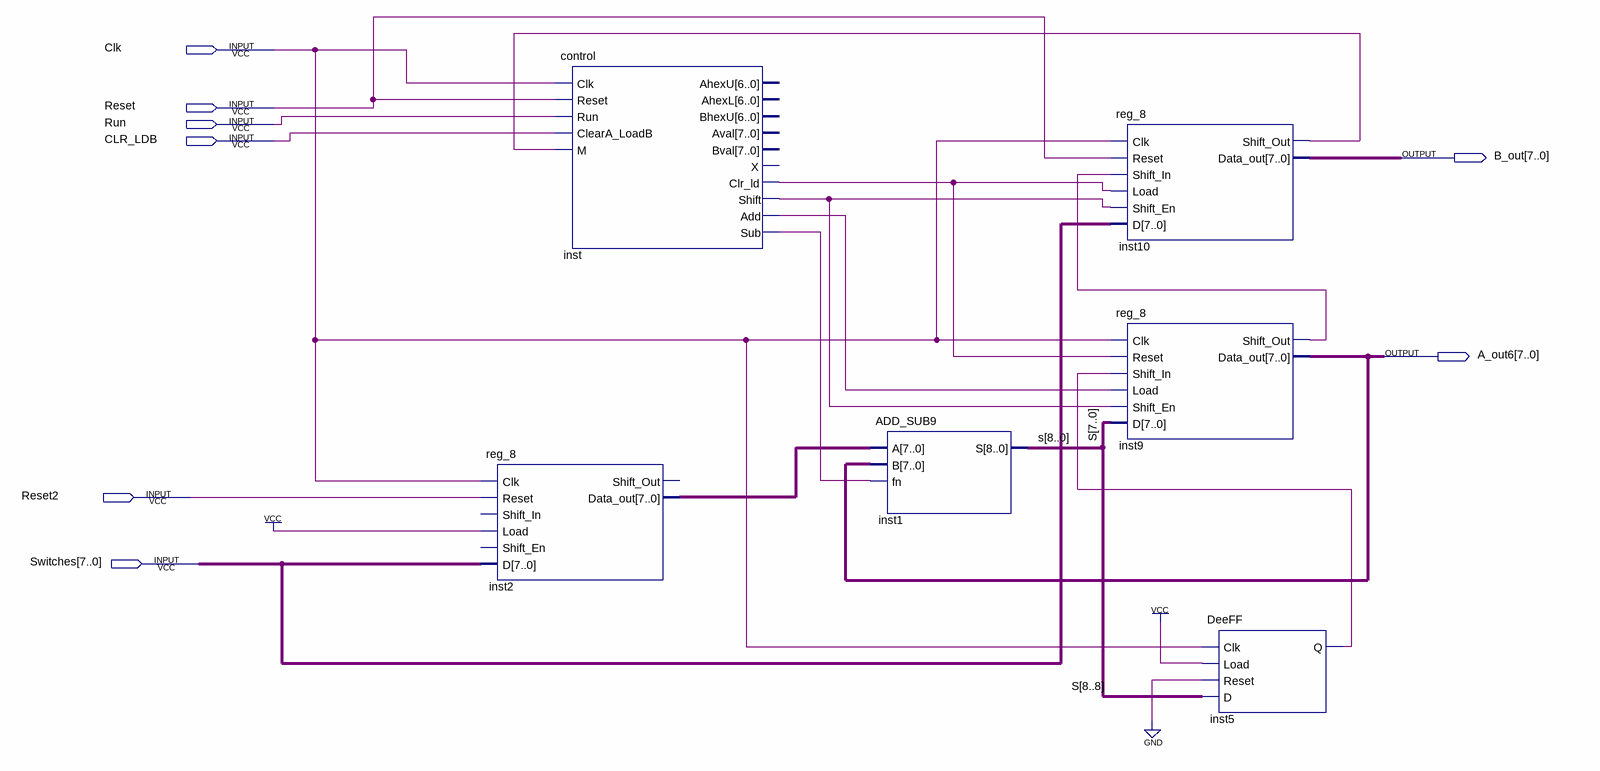
[diagram p0: schematic sheet]
// Quartus schematic my8bitmult.bdf as structural Verilog: 6 symbols, 8 pins
module my8bitmult (
  input  Clk,
  input  Reset,
  input  Run,
  input  CLR_LDB,
  input  Reset2,
  input  [7:0] Switches,
  output [7:0] B_out,
  output [7:0] A_out6
);

  wire inst5_q, inst9_shift_out, inst10_shift_out, inst_add, inst_clr_ld, inst_shift, inst_sub;
  wire [7:0] inst2_data_out;
  wire [8:0] s;

  reg_8 inst2 (
    .Clk(Clk), .Reset(Reset2), .Load(1'b1), .D(Switches), .Data_out(inst2_data_out));  // open: Shift_In, Shift_En, Shift_Out
  control inst (
    .Clk(Clk), .Reset(Reset), .Run(Run), .ClearA_LoadB(CLR_LDB), .M(inst10_shift_out), .Clr_ld(inst_clr_ld),
    .Shift(inst_shift), .Add(inst_add), .Sub(inst_sub));  // open: AhexU, AhexL, BhexU, Aval, Bval, X
  ADD_SUB9 inst1 (.A(inst2_data_out), .B(A_out6), .fn(inst_sub), .S(s));
  reg_8 inst10 (
    .Clk(Clk), .Reset(Reset), .Shift_In(inst9_shift_out), .Load(inst_clr_ld), .Shift_En(inst_shift),
    .D(Switches), .Shift_Out(inst10_shift_out), .Data_out(B_out));
  reg_8 inst9 (
    .Clk(Clk), .Reset(inst_clr_ld), .Shift_In(inst5_q), .Load(inst_add), .Shift_En(inst_shift), .D(s[7:0]),
    .Shift_Out(inst9_shift_out), .Data_out(A_out6));
  DeeFF inst5 (.Clk(Clk), .Load(1'b1), .Reset(1'b0), .D(s[8]), .Q(inst5_q));
endmodule
